# Altium schematic sheet Power.SchDoc
size 114 x 152 mm; SheetNumber: 4; SheetTotal: 6
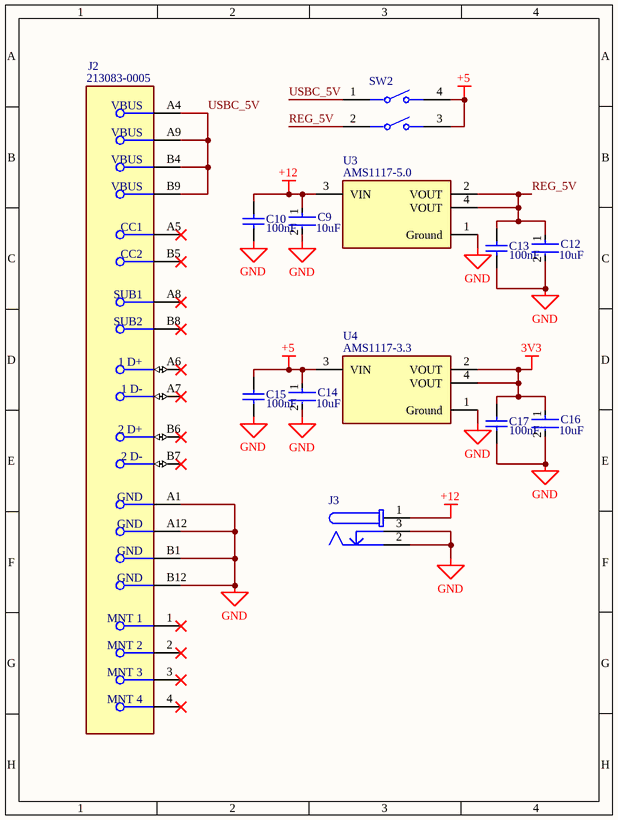
[diagram p0: Power.SchDoc]

## Parts
C9  Capacitance: 10uF  [FP-1206-L_3_2_0_2-W_1_6_0-IPC_B]  (hidden comment: 1206YD106KAT2A)
C10  value 100nF  [CAPC2013X140X50LL20T25]  (hidden comment: 08055F104KAT2A)
C12  Capacitance: 10uF  [FP-1206-L_3_2_0_2-W_1_6_0-IPC_B]  (hidden comment: 1206YD106KAT2A)
C13  value 100nF  [CAPC2013X140X50LL20T25]  (hidden comment: 08055F104KAT2A)
C14  Capacitance: 10uF  [FP-1206-L_3_2_0_2-W_1_6_0-IPC_B]  (hidden comment: 1206YD106KAT2A)
C15  value 100nF  [CAPC2013X140X50LL20T25]  (hidden comment: 08055F104KAT2A)
C16  Capacitance: 10uF  [FP-1206-L_3_2_0_2-W_1_6_0-IPC_B]  (hidden comment: 1206YD106KAT2A)
C17  value 100nF  [CAPC2013X140X50LL20T25]  (hidden comment: 08055F104KAT2A)
J2  213083-0005  [FP-2130830005-MFG]
J3  694106301002  [694106301002]  (value not drawn)
SW2  A6T-2104  [FP-A6T-2104-MFG]  (value not drawn)
U3  AMS1117-5.0  [FP-AMS1117-IPC_C]
U4  AMS1117-3.3  [FP-AMS1117-IPC_C]

## Nets
3V3: C16.1 C17.2 U4.2(VOUT) U4.4(VOUT)
+5: C14.1 C15.2 SW2.3 SW2.4 U4.3(VIN)
+12: C9.1 C10.2 J3.1 U3.3(VIN)
GND: C9.2 C10.1 C12.2 C13.1 C14.2 C15.1 C16.2 C17.1 J2.A1(GND) J2.A12(GND) J2.B1(GND) J2.B12(GND) J3.2 J3.3 U3.1(Ground) U4.1(Ground)
REG_5V: C12.1 C13.2 SW2.2 U3.2(VOUT) U3.4(VOUT)
USBC_5V: J2.A4(VBUS) J2.A9(VBUS) J2.B4(VBUS) J2.B9(VBUS) SW2.1

Not connected (* = marked no-connect by the designer): J2 1(MNT_1)* 2(MNT_2)* 3(MNT_3)* 4(MNT_4)* A5(CC1)* A6(1_D+)* A7(1_D-)* A8(SUB1)* B5(CC2)* B6(2_D+)* B7(2_D-)* B8(SUB2)*

## Library data of the parts
C9 C12 C14 C16 = CMP-04427-000082-1: General Purpose Ceramic Capacitor, 1206, 10uF, 10%, X5R, 15%, 16V; Max Operating Temperature: 85°C; Tolerance: 10%; Dielectric: X5R; Series: -; Case Code (Imperial): 1206; Width: 1.6mm; Termination: SMD/SMT; Voltage Rating: 16V; REACH SVHC: No SVHC; Length: 3.2mm; Size: 1.78mm; Package Quantity: 1; Voltage: 16V; RoHS Compliant: Yes; Thickness: 0.07inch; Mount: Surface Mount; Radiation Hardening: No; Voltage Rating (DC): 16V; Min Operating Temperature: -55°C; Case Code (Metric): 3216; Construction: Flat; Depth: 1.6mm; Height: 0.07mm; Lead Free: Lead Free; Number of Pins: 2; Case/Package: 1206; Packaging: Tape and Reel
C10 C13 C15 C17 = CMP-2007-04784-1: Manufacturer: AVX Interconnect / Elco; Part Number: 08055F104KAT2A
J2 = CMP-04767-000030-2: CONN RCP USB2.0 TYP C 24P SMD RA; NexarPartId: 114105384; Current Rating: 5A; Number of Contacts: 16; Voltage Rating: 30V; Gender: Receptacle; Min Operating Temperature: -40°C; USB Standard: USB 2.0; Max Operating Temperature: 85°C; Contact Material: Gold, Nickel; Schedule B: 8536695050, 8536695050; Country of Origin: CN
J3 = CMP-1502-00188-2: NexarPartId: 52676100; Voltage Rating (DC): 20V; Gender: Male; Voltage Rating: 24V; Connector Type: Power; Insulation Resistance: 100MΩ; Current Rating: 5A; Shielding: Unshielded; Number of Contacts: 3; Color: Black; Housing Material: Polyamide; Contact Gender: Female; REACH SVHC: Unknown; Termination: Through Hole; Height: 11mm; RoHS: Compliant; Mount: Through Hole; Flammability Rating: UL94 V-0; Packaging: Bulk; Min Operating Temperature: -40°C; Contact Plating: Tin; Max Operating Temperature: 85°C; Operating Supply Voltage: 24V; Contact Material: Gold, Tin
SW2 = CMP-08827-000029-1: SWITCH SLIDE DIP SPST 25MA 24V; Pitch: 0.1inch; Contact Resistance: 200mR; Electrical Life: 1000Cycles; Number of Circuits: 2; Washable: No; Actuator Length: 0.6mm; Actuator Type: Slide (Standard); Max Current Rating: 25mA; Termination: PC Pins; Mount: Through Hole; Max Operating Temperature: 70°C; Throw Configuration: SPST; Packaging: Rail/Tube; Contact Current Rating: 25mA; Current Rating: 25mA; Case/Package: DIP; Width: 6.2mm; Radiation Hardening: No; Lead Free: Lead Free; Series: A6T; Package Quantity: 76; Voltage Rating (DC): 24V; Min Operating Temperature: -20°C; Contact Plating: Gold; Number of Positions: 2; Orientation: Straight; RoHS Compliant: Yes; Terminal Pitch: 2.54mm; Weight: 0.26g; Length: 0.237inch; Max Voltage Rating (DC): 24V; Mechanical Life: 1000Cycles; Height: 4.2mm; Contact Material: Gold
U3 = CMP-209535-000001-1: LDO Voltage Regulators 1A, 3.3V; Manufacturer Part Number: AMS1117-3.3; Manufacturer: Advanced Monolithic Systems; Dropout Voltage: 1.1V; Output Type: Fixed; Nominal Supply Current: 5mA; Max Power Dissipation: 1.2W; Max Supply Voltage: 15V; Number Of Outputs: 1; Standoff Height: 0.64mm; Max Junction Temp: +125°C; Height: 1.8mm; Package: AMS1117; Device Class L2: Power Management ICs; ComponentLink2Description: Datasheet; ComponentLink2URL: http://www.advanced-monolithic.com/pdf/ds1117.pdf; Category: IC; RoHS: TRUE; Automotive: No; Device Class L1: Integrated Circuits (ICs); Output Current: 1A; Device Class L3: Voltage Regulators - Linear; Temperature: -40°C to +125°C; Output Voltage: 3.3V; Temperature Range Low: -40°C; Octopart: https://octopart.com/ams1117-3.3-advanced+monolithic+systems-25899300; Lead Free: Yes; Ipc Land Pattern Name: SOT229P700X180-4; Temperature Range High: +125°C
U4 = CMP-209535-000001-1: LDO Voltage Regulators 1A, 3.3V; Manufacturer: Advanced Monolithic Systems; Dropout Voltage: 1.1V; Output Type: Fixed; Nominal Supply Current: 5mA; Max Power Dissipation: 1.2W; Max Supply Voltage: 15V; Number Of Outputs: 1; Standoff Height: 0.64mm; Max Junction Temp: +125°C; Height: 1.8mm; Package: AMS1117; Device Class L2: Power Management ICs; ComponentLink2Description: Datasheet; ComponentLink2URL: http://www.advanced-monolithic.com/pdf/ds1117.pdf; Category: IC; RoHS: TRUE; Automotive: No; Device Class L1: Integrated Circuits (ICs); Output Current: 1A; Device Class L3: Voltage Regulators - Linear; Temperature: -40°C to +125°C; Output Voltage: 3.3V; Manufacturer Part Number: AMS1117-3.3; Temperature Range Low: -40°C; Octopart: https://octopart.com/ams1117-3.3-advanced+monolithic+systems-25899300; Lead Free: Yes; Ipc Land Pattern Name: SOT229P700X180-4; Temperature Range High: +125°C